# EAGLE design EEZ DIB MUX14D r1B2 (EAGLE 7.2.0)
Assembly variants: Farnell, TME

## Sheet 1 of 3: DIB interface
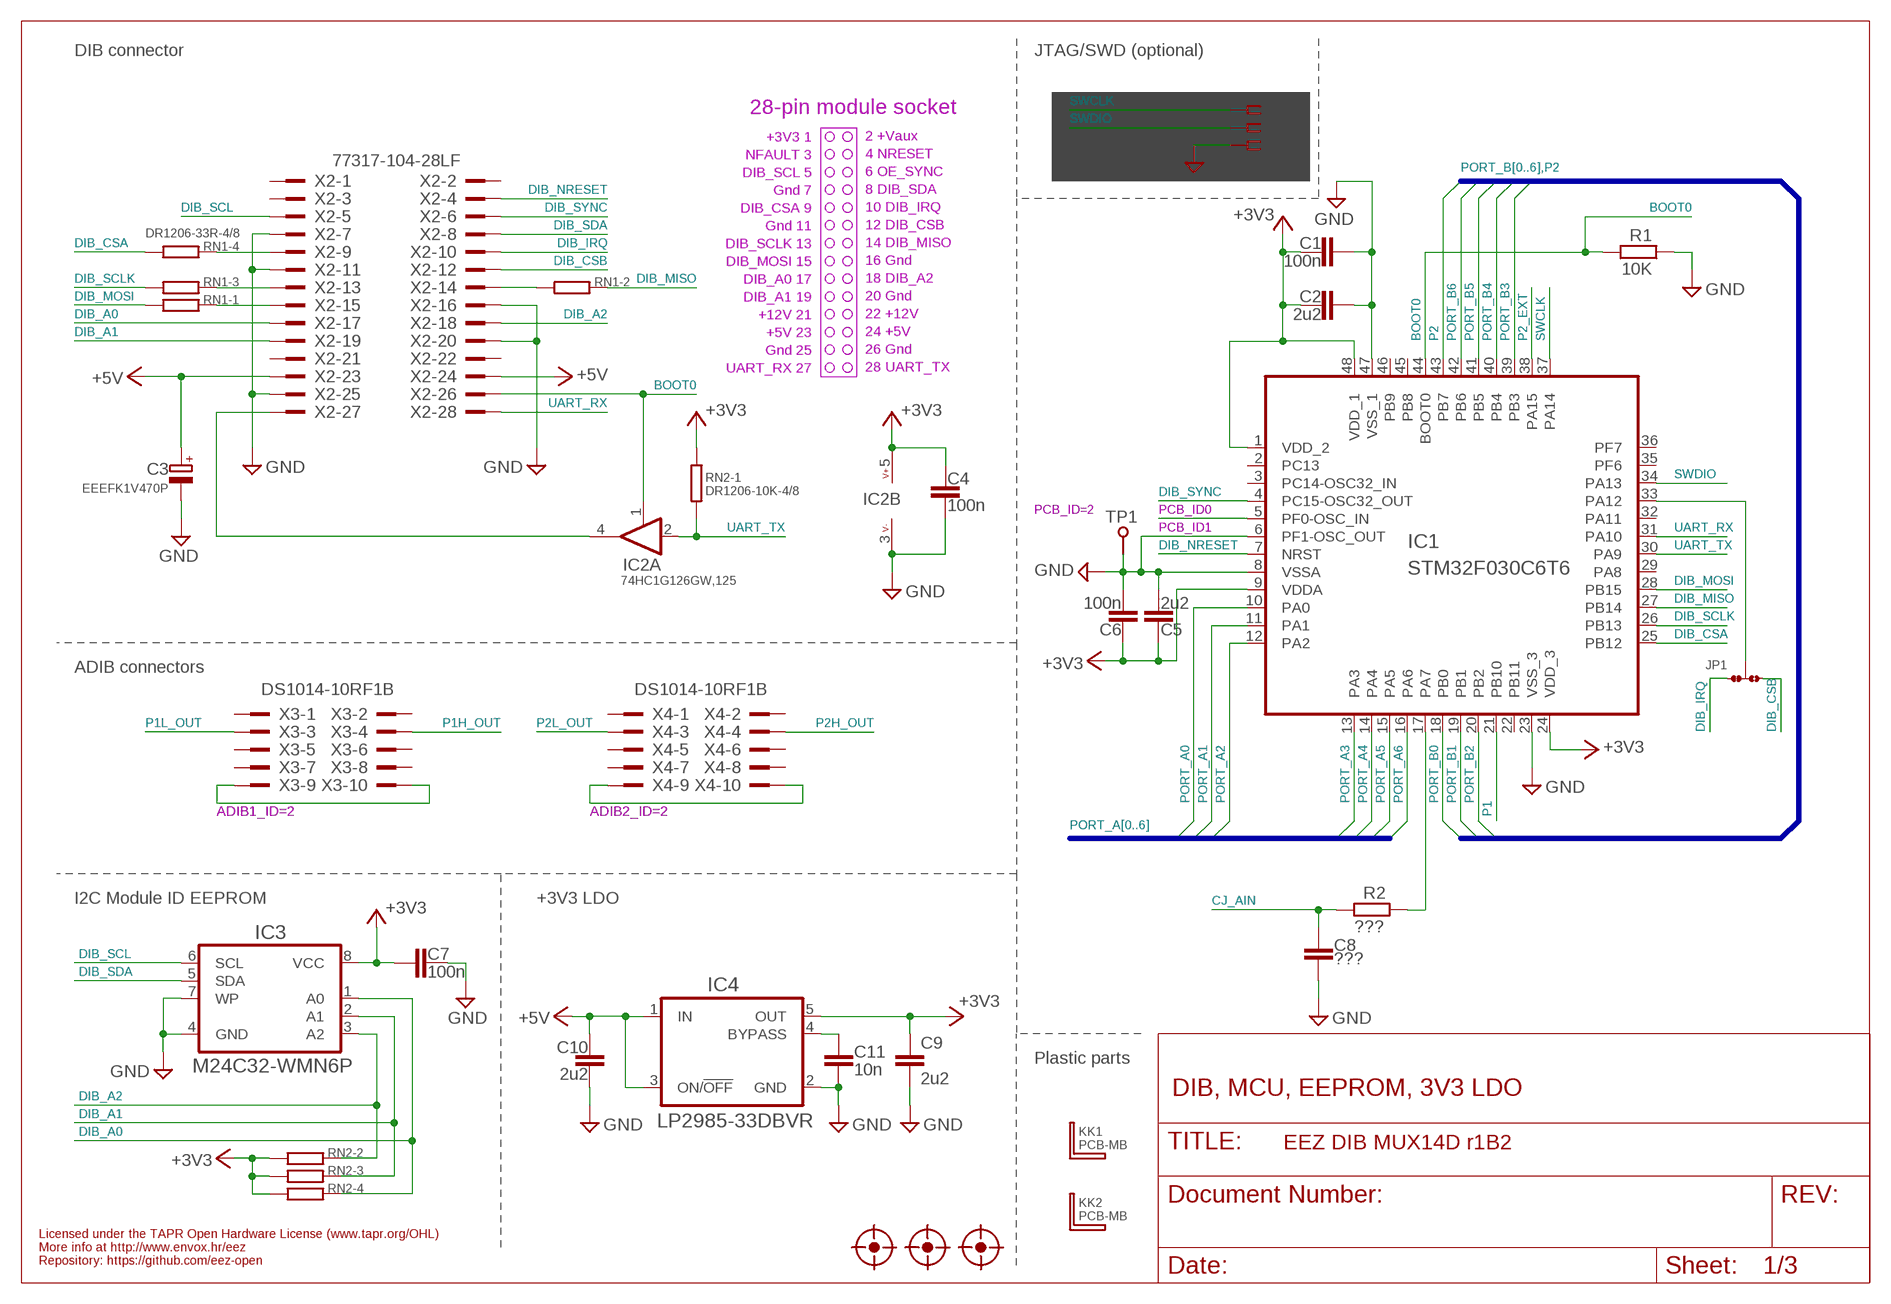
[diagram p0: schematic, sheet 1]

### Parts
C1  100n  C-EUC0603  [C0603]
C2  2u2  C-EUC0805  [C0805]
C3  EEEFK1V470P  ECAPPANASONIC_H  [CAPAE660X610N]
C4  100n  C-EUC0603  [C0603]
C5  2u2  C-EUC0805  [C0805]
C6  100n  C-EUC0603  [C0603]
C7  100n  C-EUC0603  [C0603]
C8  ???  C-EUC0805  [C0805]
C9  2u2  C-EUC0805  [C0805]
C10  2u2  C-EUC0805  [C0805]
C11  10n  C-EUC0805  [C0805]
FM1  FIDUCIAL_2  [FIDUCIAL_DUAL]
FM2  FIDUCIAL_2  [FIDUCIAL_DUAL]
FM3  FIDUCIAL_2  [FIDUCIAL_DUAL]
IC1  STM32F030C6T6  [LQFP-48]
IC2  74HC1G126GW,125  [SOT65P210X110-5N]
IC3  M24C32-WMN6P  AT24CXXSOIC8  [SOIC127P600X173-8N]
IC4  LP2985-33DBVR  LP2985  [SOT95P270X145-5N]
JP1  JP3-CUT-0805-ROTATED  [JP3-0805-CUT2]
KK1  PCB-MB  [PCB-MB]
KK2  PCB-MB  [PCB-MB]
R1  10K  R-EU_R0805  [R0805]
R2  ???  R-EU_R0805  [R0805]
RN1  DR1206-33R-4/8  R_ARRAY4  [CAY16]
RN2  DR1206-10K-4/8  R_ARRAY4  [CAY16]
TP1  PCB_TEST_TABSHIELD  [PCB_SHIELD_TAB]
X1  N.C.  SSW-106-02-S-S  [SSW-106-02-S-S]
X2  77317-104-28LF  [77317-104-28LF]
X3  DS1014-10RF1B  [DS1014-10RF1B]
X4  DS1014-10RF1B  [DS1014-10RF1B]

### Nets
+3V3: C1.2 C2.1 C4.1 C5.2 C6.1 C7.2 C9.1 IC1.1(VDD_2) IC1.9(VDDA) IC1.24(VDD_3) IC1.48(VDD_1) IC2.5(B:V+) IC3.8(VCC) IC4.5(OUT) RN2.5 RN2.6 RN2.7 RN2.8 ; also sheet 2
+5V: C3.1(+) C10.2 IC4.1(IN) IC4.3(ON/!OFF) X2.23 X2.24 ; also sheet 2,3
BOOT0: IC1.44(BOOT0) IC2.1(A:EN) R1.2 X2.26
CJ_AIN: C8.2 R2.2 ; also sheet 2
DIB_A0: IC3.1(A0) RN2.4 X2.17
DIB_A1: IC3.2(A1) RN2.3 X2.19
DIB_A2: IC3.3(A2) RN2.2 X2.18
DIB_CSA: IC1.25(PB12) RN1.4
DIB_CSB: JP1.NO X2.12
DIB_IRQ: JP1.NC X2.10
DIB_MISO: IC1.27(PB14) RN1.2
DIB_MOSI: IC1.28(PB15) RN1.1
DIB_NRESET: IC1.7(NRST) X2.4
DIB_SCL: IC3.6(SCL) X2.5
DIB_SCLK: IC1.26(PB13) RN1.3
DIB_SDA: IC3.5(SDA) X2.8
DIB_SYNC: IC1.4(PC15-OSC32_OUT) X2.6
GND: C1.1 C2.2 C3.2(-) C4.2 C5.1 C6.2 C7.1 C8.1 C9.2 C10.1 C11.1 IC1.6(PF1-OSC_OUT) IC1.8(VSSA) IC1.23(VSS_3) IC1.47(VSS_1) IC2.3(B:V-) IC3.4(GND) IC3.7(WP) IC4.2(GND) R1.1 TP1.1 X1.3 X2.7 X2.11 X2.16 X2.20 X2.25 ; also sheet 2,3
N$1: X3.9 X3.10
N$2: X4.9 X4.10
N$6: IC1.17(PA7) R2.1
N$7: IC1.5(PF0-OSC_IN)
N$69: RN1.5 X2.9
N$70: C11.2 IC4.4(BYPASS)
N$72: IC2.4(A:O) X2.27
N$75: IC1.33(PA12) JP1.COM
N$99: RN1.6 X2.13
N$101: RN1.7 X2.14
N$102: RN1.8 X2.15
P1: IC1.21(PB10) ; also sheet 3
P1H_OUT: X3.4 ; also sheet 2
P1L_OUT: X3.3 ; also sheet 2
P2: IC1.43(PB7) ; also sheet 3
P2_EXT: IC1.38(PA15) ; also sheet 3
P2H_OUT: X4.4 ; also sheet 2
P2L_OUT: X4.3 ; also sheet 2
PORT_A0: IC1.10(PA0) ; also sheet 3
PORT_A1: IC1.11(PA1) ; also sheet 3
PORT_A2: IC1.12(PA2) ; also sheet 3
PORT_A3: IC1.13(PA3) ; also sheet 3
PORT_A4: IC1.14(PA4) ; also sheet 3
PORT_A5: IC1.15(PA5) ; also sheet 3
PORT_A6: IC1.16(PA6) ; also sheet 3
PORT_B0: IC1.18(PB0) ; also sheet 3
PORT_B1: IC1.19(PB1) ; also sheet 3
PORT_B2: IC1.20(PB2) ; also sheet 3
PORT_B3: IC1.39(PB3) ; also sheet 3
PORT_B4: IC1.40(PB4) ; also sheet 3
PORT_B5: IC1.41(PB5) ; also sheet 3
PORT_B6: IC1.42(PB6) ; also sheet 3
SWCLK: IC1.37(PA14) X1.2
SWDIO: IC1.34(PA13) X1.4
UART_RX: IC1.31(PA10) X2.28
UART_TX: IC1.30(PA9) IC2.2(A:I) RN2.1
Unconnected: IC1.2(PC13) IC1.3(PC14-OSC32_IN) IC1.22(PB11) IC1.29(PA8) IC1.32(PA11) IC1.35(PF6) IC1.36(PF7) IC1.45(PB8) IC1.46(PB9) X1.1 X1.5 X1.6 X2.1 X2.2 X2.3 X2.21 X2.22 X3.1 X3.2 X3.5 X3.6 X3.7 X3.8 X4.1 X4.2 X4.5 X4.6 X4.7 X4.8

### Buses
PORT_A[0..6]
PORT_B[0..6],P2

### Notes on the sheet
- DIB connector | JTAG/SWD (optional)
- 28-pin module socket
- +3V3 1
- 2 +Vaux
- NFAULT 3
- 4 NRESET
- DIB_SCL 5
- 6 OE_SYNC
- Gnd 7
- 8 DIB_SDA
- DIB_CSA 9
- 10 DIB_IRQ
- Gnd 11
- 12 DIB_CSB
- DIB_SCLK 13
- 14 DIB_MISO
- DIB_MOSI 15
- 16 Gnd
- DIB_A0 17
- 18 DIB_A2
- DIB_A1 19
- 20 Gnd
- +12V 21
- 22 +12V
- +5V 23
- 24 +5V
- Gnd 25
- 26 Gnd
- UART_RX 27
- 28 UART_TX
- PCB_ID=2 | PCB_ID0
- PCB_ID1
- ADIB connectors
- ADIB1_ID=2 | ADIB2_ID=2
- I2C Module ID EEPROM | +3V3 LDO
- Plastic parts
- DIB, MCU, EEPROM, 3V3 LDO
- Licensed under the TAPR Open Hardware License (www.tapr.org/OHL)
- More info at http://www.envox.hr/eez
- Repository: https://github.com/eez-open

## Sheet 2 of 3
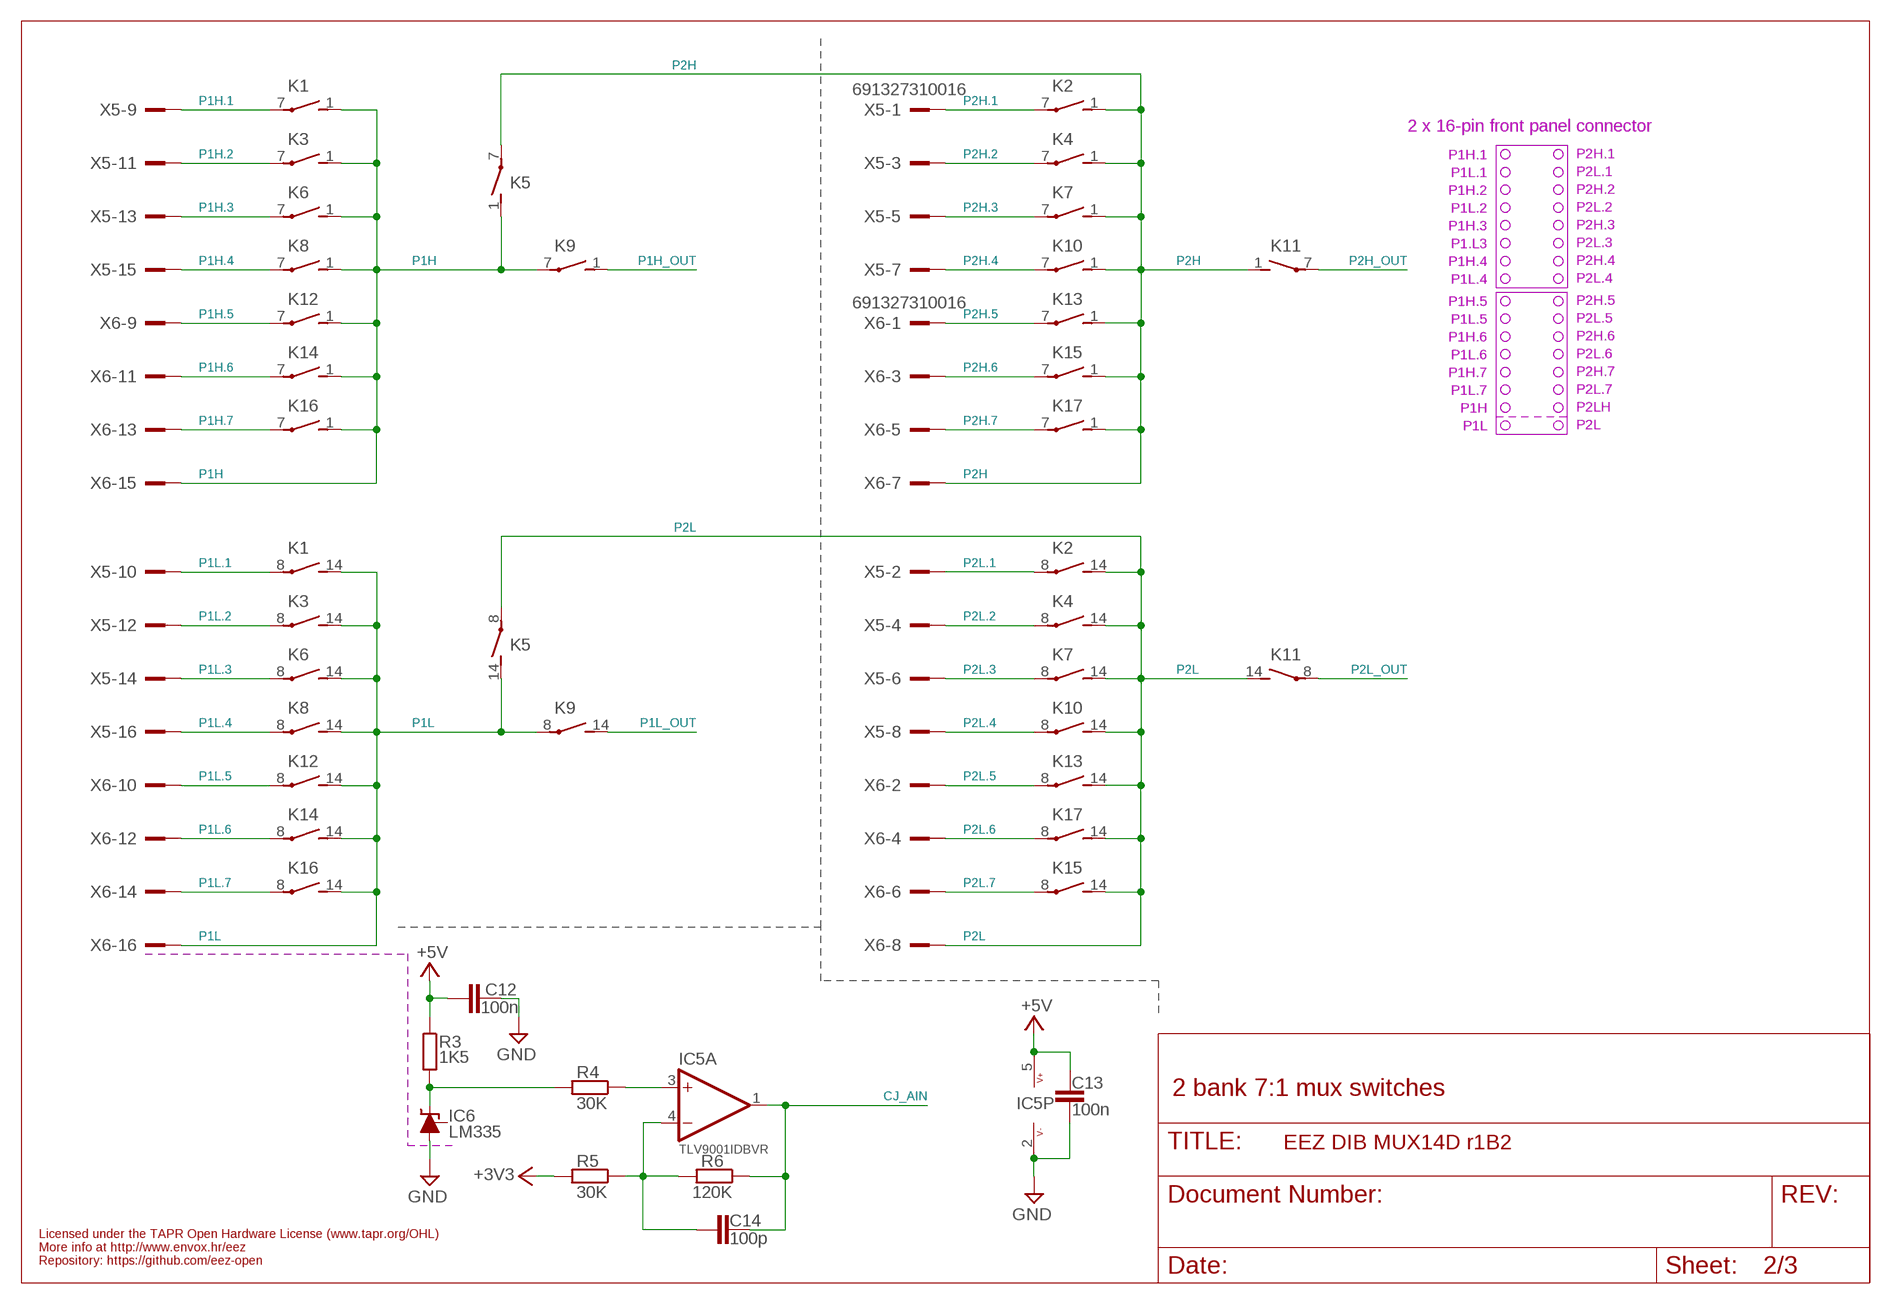
[diagram p1: schematic, sheet 2]

### Parts
C12  100n  C-EUC0603  [C0603]
C13  100n  C-EUC0603  [C0603]
C14  100p  C-EUC0805  [C0805]
IC5  TLV9001IDBVR  OPA376AIDBVR  [DBV5]
IC6  LM335  LM335-TO92  [TO92]
K1  3572.1220.051  RR2A  [RR2A]
K2  3572.1220.051  RR2A  [RR2A]
K3  3572.1220.051  RR2A  [RR2A]
K4  3572.1220.051  RR2A  [RR2A]
K5  3572.1220.051  RR2A  [RR2A]
K6  3572.1220.051  RR2A  [RR2A]
K7  3572.1220.051  RR2A  [RR2A]
K8  3572.1220.051  RR2A  [RR2A]
K9  3572.1220.051  RR2A  [RR2A]
K10  3572.1220.051  RR2A  [RR2A]
K11  3572.1220.051  RR2A  [RR2A]
K12  3572.1220.051  RR2A  [RR2A]
K13  3572.1220.051  RR2A  [RR2A]
K14  3572.1220.051  RR2A  [RR2A]
K15  3572.1220.051  RR2A  [RR2A]
K16  3572.1220.051  RR2A  [RR2A]
K17  3572.1220.051  RR2A  [RR2A]
R3  1K5  R-EU_R0805  [R0805]
R4  30K  R-EU_R0805  [R0805]
R5  30K  R-EU_R0805  [R0805]
R6  120K  R-EU_R0805  [R0805]
X5  691327310016  [691327310016]
X6  691327310016  [691327310016]

### Nets
+3V3: R5.2 ; also sheet 1
+5V: C12.1 C13.1 IC5.5(P:V+) R3.1 ; also sheet 1,3
CJ_AIN: C14.2 IC5.1(A:OUT) R6.1 ; also sheet 1
GND: C12.2 C13.2 IC5.2(P:V-) IC6.3(A) ; also sheet 1,3
N$3: IC6.2(C) R3.2 R4.2
N$183: C14.1 IC5.4(A:-IN) R5.1 R6.2
N$184: IC5.3(A:+IN) R4.1
P1H: K1.1(2:S) K3.1(2:S) K5.1(2:S) K6.1(2:S) K8.1(2:S) K9.7(2:P) K12.1(2:S) K14.1(2:S) K16.1(2:S) X6.15
P1H.1: K1.7(2:P) X5.9
P1H.2: K3.7(2:P) X5.11
P1H.3: K6.7(2:P) X5.13
P1H.4: K8.7(2:P) X5.15
P1H.5: K12.7(2:P) X6.9
P1H.6: K14.7(2:P) X6.11
P1H.7: K16.7(2:P) X6.13
P1H_OUT: K9.1(2:S) ; also sheet 1
P1L: K1.14(3:S) K3.14(3:S) K5.14(3:S) K6.14(3:S) K8.14(3:S) K9.8(3:P) K12.14(3:S) K14.14(3:S) K16.14(3:S) X6.16
P1L.1: K1.8(3:P) X5.10
P1L.2: K3.8(3:P) X5.12
P1L.3: K6.8(3:P) X5.14
P1L.4: K8.8(3:P) X5.16
P1L.5: K12.8(3:P) X6.10
P1L.6: K14.8(3:P) X6.12
P1L.7: K16.8(3:P) X6.14
P1L_OUT: K9.14(3:S) ; also sheet 1
P2H: K2.1(2:S) K4.1(2:S) K5.7(2:P) K7.1(2:S) K10.1(2:S) K11.1(2:S) K13.1(2:S) K15.1(2:S) K17.1(2:S) X6.7
P2H.1: K2.7(2:P) X5.1
P2H.2: K4.7(2:P) X5.3
P2H.3: K7.7(2:P) X5.5
P2H.4: K10.7(2:P) X5.7
P2H.5: K13.7(2:P) X6.1
P2H.6: K15.7(2:P) X6.3
P2H.7: K17.7(2:P) X6.5
P2H_OUT: K11.7(2:P) ; also sheet 1
P2L: K2.14(3:S) K4.14(3:S) K5.8(3:P) K7.14(3:S) K10.14(3:S) K11.14(3:S) K13.14(3:S) K15.14(3:S) K17.14(3:S) X6.8
P2L.1: K2.8(3:P) X5.2
P2L.2: K4.8(3:P) X5.4
P2L.3: K7.8(3:P) X5.6
P2L.4: K10.8(3:P) X5.8
P2L.5: K13.8(3:P) X6.2
P2L.6: K17.8(3:P) X6.4
P2L.7: K15.8(3:P) X6.6
P2L_OUT: K11.8(3:P) ; also sheet 1
Unconnected: IC6.1(ADJ)

### Notes on the sheet
- 2 x 16-pin front panel connector
- P1H.1
- P2H.1
- P1L.1
- P2L.1
- P1H.2
- P2H.2
- P1L.2
- P2L.2
- P1H.3
- P2H.3
- P1.L3
- P2L.3
- P1H.4
- P2H.4
- P1L.4
- P2L.4
- P1H.5
- P2H.5
- P1L.5
- P2L.5
- P1H.6
- P2H.6
- P1L.6
- P2L.6
- P1H.7
- P2H.7
- P1L.7
- P2L.7
- P1H
- P2LH
- P1L
- P2L
- 2 bank 7:1 mux switches
- Licensed under the TAPR Open Hardware License (www.tapr.org/OHL)
- More info at http://www.envox.hr/eez
- Repository: https://github.com/eez-open

## Sheet 3 of 3
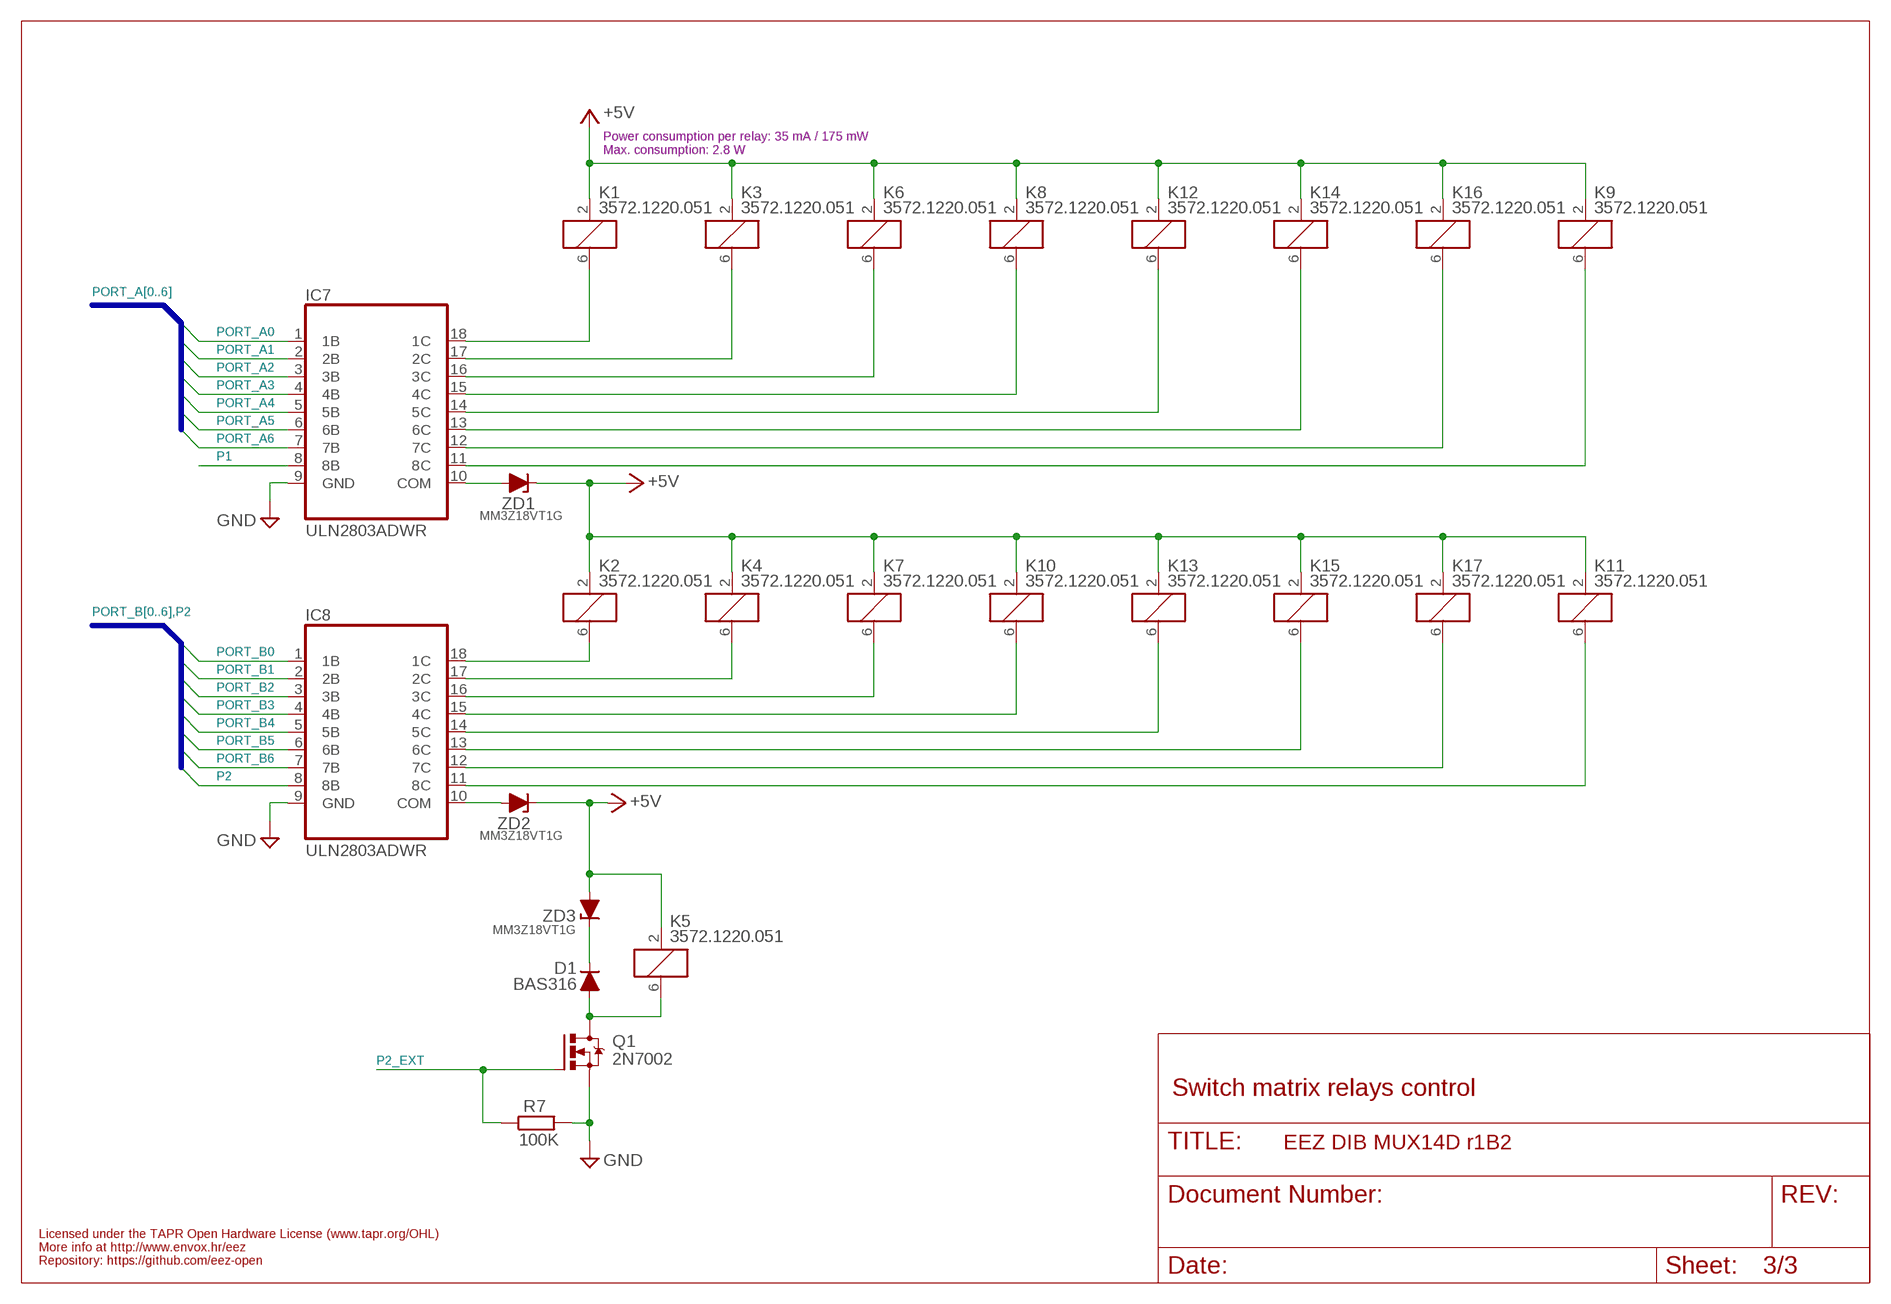
[diagram p2: schematic, sheet 3]

### Parts
D1  BAS316  DIODESOD323R  [SOD323-R]
IC7  ULN2803ADWR  [DW18_TEX-M]
IC8  ULN2803ADWR  [DW18_TEX-M]
Q1  2N7002  [SOT103P240X110-3N]
R7  100K  R-EU_R0805  [R0805]
ZD1  MM3Z18VT1G  ZENER-DIODESOD323R  [SOD323-R]
ZD2  MM3Z18VT1G  ZENER-DIODESOD323R  [SOD323-R]
ZD3  MM3Z18VT1G  ZENER-DIODESOD323R  [SOD323-R]

### Nets
+5V: K1.2 K2.2 K3.2 K4.2 K5.2 K6.2 K7.2 K8.2 K9.2 K10.2 K11.2 K12.2 K13.2 K14.2 K15.2 K16.2 K17.2 ZD1.C ZD2.C ZD3.A ; also sheet 1,2
GND: IC7.9(GND) IC8.9(GND) Q1.2(S) R7.2 ; also sheet 1,2
N$4: D1.C ZD3.C
N$28: IC7.10(COM) ZD1.A
N$30: IC7.18(1C) K1.6
N$32: IC7.17(2C) K3.6
N$34: IC7.16(3C) K6.6
N$35: IC7.15(4C) K8.6
N$36: IC7.14(5C) K12.6
N$38: IC7.13(6C) K14.6
N$40: IC7.12(7C) K16.6
N$42: IC7.11(8C) K9.6
N$43: D1.A K5.6 Q1.3(D)
N$44: IC8.10(COM) ZD2.A
N$46: IC8.18(1C) K2.6
N$48: IC8.17(2C) K4.6
N$50: IC8.16(3C) K7.6
N$52: IC8.15(4C) K10.6
N$54: IC8.14(5C) K13.6
N$56: IC8.13(6C) K15.6
N$58: IC8.12(7C) K17.6
N$60: IC8.11(8C) K11.6
P1: IC7.8(8B) ; also sheet 1
P2: IC8.8(8B) ; also sheet 1
P2_EXT: Q1.1(G) R7.1 ; also sheet 1
PORT_A0: IC7.1(1B) ; also sheet 1
PORT_A1: IC7.2(2B) ; also sheet 1
PORT_A2: IC7.3(3B) ; also sheet 1
PORT_A3: IC7.4(4B) ; also sheet 1
PORT_A4: IC7.5(5B) ; also sheet 1
PORT_A5: IC7.6(6B) ; also sheet 1
PORT_A6: IC7.7(7B) ; also sheet 1
PORT_B0: IC8.1(1B) ; also sheet 1
PORT_B1: IC8.2(2B) ; also sheet 1
PORT_B2: IC8.3(3B) ; also sheet 1
PORT_B3: IC8.4(4B) ; also sheet 1
PORT_B4: IC8.5(5B) ; also sheet 1
PORT_B5: IC8.6(6B) ; also sheet 1
PORT_B6: IC8.7(7B) ; also sheet 1

### Buses
PORT_A[0..6]
PORT_B[0..6],P2

### Notes on the sheet
- Power consumption per relay: 35 mA / 175 mW
  Max. consumption: 2.8 W
- Switch matrix relays control
- Licensed under the TAPR Open Hardware License (www.tapr.org/OHL)
- More info at http://www.envox.hr/eez
- Repository: https://github.com/eez-open

## Library data of the parts
C1 C2 C4-C14 = rcl:C-EU: CAPACITOR, European symbol
C3 = EEZ_Lib1:ECAP
D1 = EEZ_Lib1:DIODE
FM1-FM3 = EEZ_Lib1:FIDUCIAL: Fiducial mark for pick and place automation
IC1 = EEZ_DIB:STM32F030: Arm® 32-bit Cortex®-M0 CPU
IC2 = EEZ_Lib1:74HC1G126: Single Bus Buffer Gate With 3-State Outputs
IC3 = EEZ_Lib1:AT24CXX: I2C-Compatible (2-wire) Serial EEPROM
IC4 = EEZ_DIB:LP2985: 150-mA Low-noise Low-dropout Regulator With Shutdown
IC5 = EEZ_TI:OPA376A: Low-Noise, Low Quiescent Current, Precision Operational Amplifier
IC6 = EEZ_TI:LM335: Precision temperature sensor
IC7 IC8 = EEZ_TI:ULN2803A: 8 Darlington Transistor Array (500mA, 50V)
JP1 = EEZ_Lib1:JP3-CUT
K1-K17 = EEZ_switches:RR2A: Reed relay, 2 Form A
KK1 KK2 = EEZ_Lib1:PCB-MB: Richo Mounting Block; 16 x 6 mm
Q1 = EEZ_Lib1:2N7002: N-CHANNEL ENHANCEMENT MODE FIELD EFFECT TRANSISTOR; MPN: 2N7002-7-F; OC_FARNELL: 1713823; OC_NEWARK: 25R5679; PACKAGE: SOT-23-3; SUPPLIER: DIODES INC.
R1-R7 = rcl:R-EU_: RESISTOR, European symbol
RN1 RN2 = EEZ_Lib1:R_ARRAY4: 1206 four resistor array
TP1 = EEZ_Lib1:PCB_TEST_TAB
X1 = con-samtec:SSW-106-02-S-S: THROUGH-HOLE .025" SQ POST SOCKET Source: Samtec SSW.pdf; MPN: SSW-106-02-S-S; OC_FARNELL: unknown; OC_NEWARK: 11P9416
X2 = EEZ_connectors:77317-104-28LF: Headers & Wire Housings 28P right angle 0.1" pitch
X3 X4 = EEZ_connectors:DS1014-10RF1B: 10-pin IDC 2mm Socket; male; 90°; THT
X5 X6 = EEZ_connectors:691327310016: WR-TBL Serie 3273 – 3.81mm Close Horizontal Dual Row PCB Header, 16 Pins
ZD1-ZD3 = EEZ_Lib1:ZENER-DIODE

## Net classes
0 default: width 0.203 mm, drill 0.3 mm, clearance 0.203 mm
1 lvds: width 0.152 mm, drill 0.3 mm, clearance 0.152 mm to class 0, clearance 0.152 mm
2 gnd: width 0.254 mm, drill 0.584 mm, clearance 0.254 mm
3 diff_in: width 0.254 mm, drill 0.584 mm, clearance 0.203 mm to class 0, clearance 0.203 mm to class 1, clearance 0.203 mm to class 2, clearance 0.203 mm

## Board
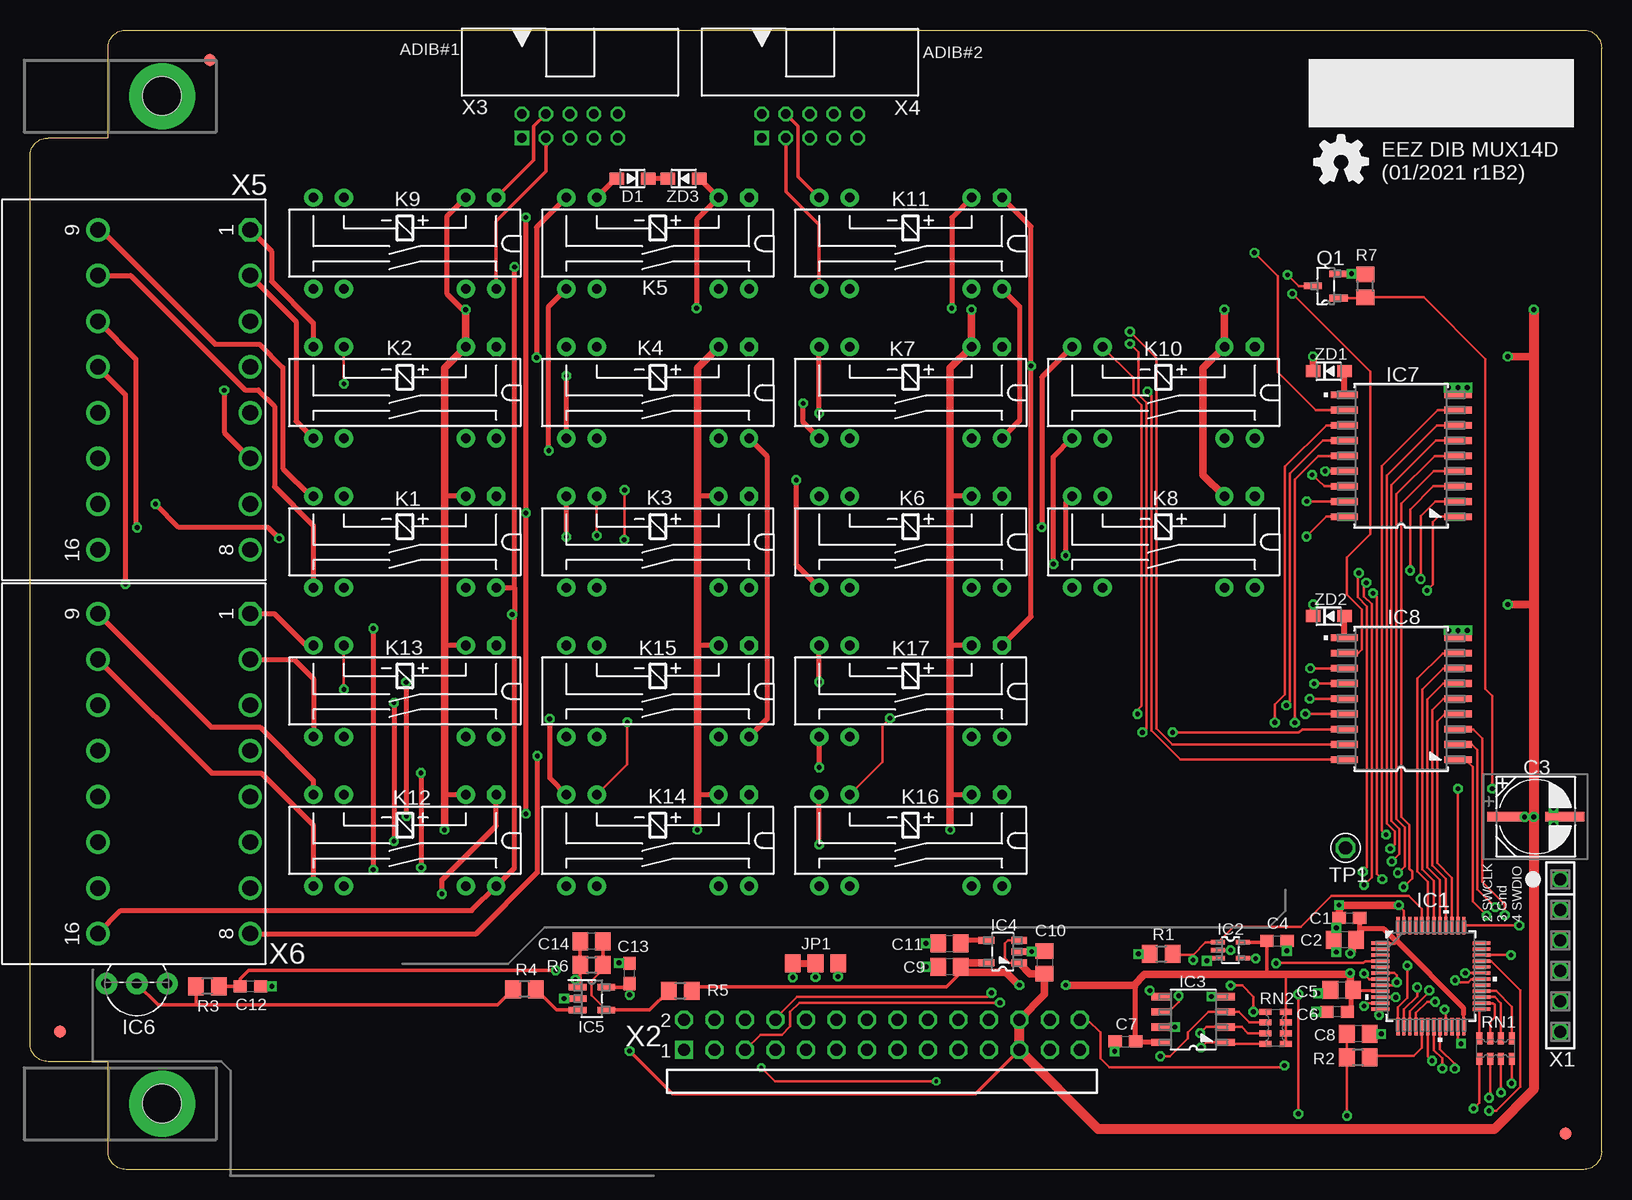
[diagram p3: board, top side]
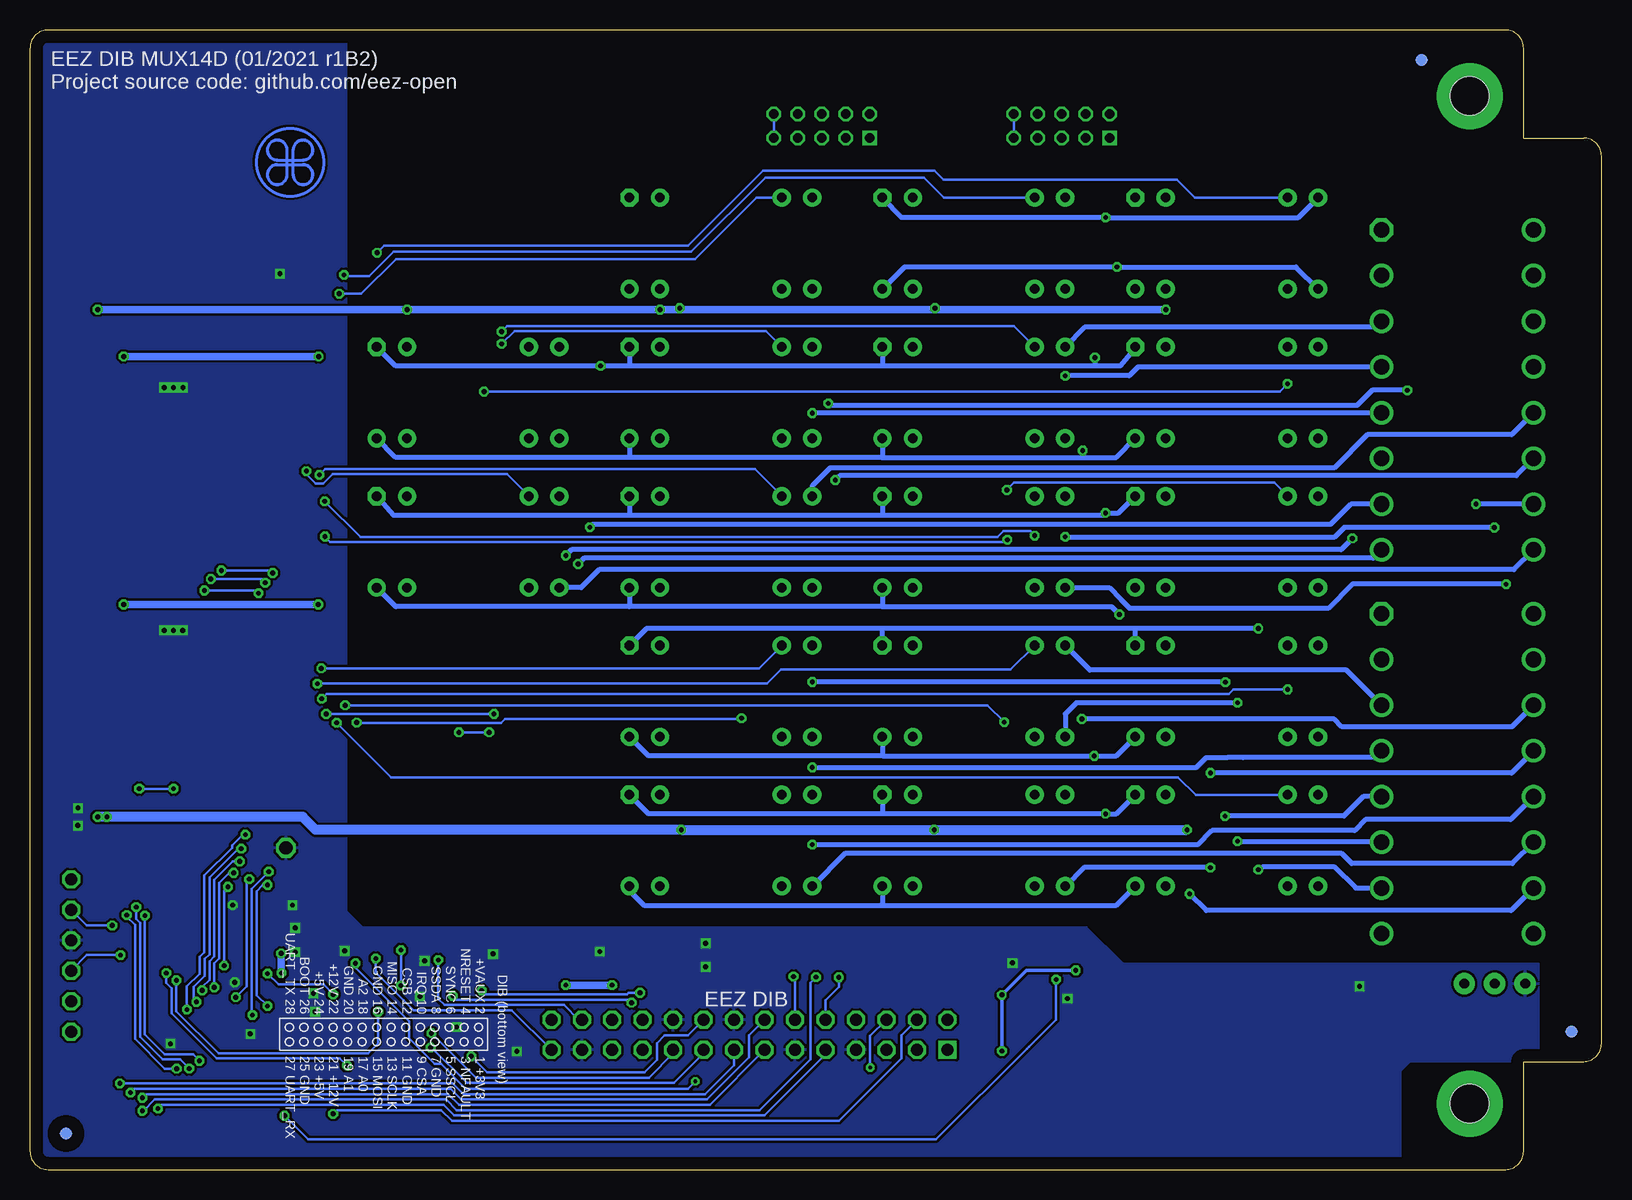
[diagram p4: board, bottom side, seen from below]

Size 131 x 95 mm. Coordinates in mm from the lower left corner, seen from the top.
Outline: 8,95 129.5,95 arc-90 131,93.5 131,1.5 arc-90 129.5,0 8,0 arc-90 6.5,1.5 6.5,9 1.5,9 arc-90 0,10.5 0,84.5 arc-90 1.5,86 6.5,86 6.5,93.5 arc-90 8,95
Copper layers (1*16): Top 0.035mm / dielectric 1.5mm / Bottom 0.035mm
Design rules "default *": minimum track width 6mil, minimum drill 0.3mm, track to track 6mil, track to pad 6mil, pad to pad 6mil, via to via 6mil, smd to smd 6mil, copper to edge 40mil, drill to drill 8mil, minimum pad ring 4mil, minimum via ring 8mil, stop-mask expansion 2.5mil, vias tented up to drill 1mm, thermal gap 8mil
vRestrict: area 0,0 to 42,14; area 53,0 to 128,8.5

### Footprints (pad centres in the part's own frame; a part is rotated, then mirrored left to right if it is on the bottom)
C0603 = smd 1.1 x 1: 1 -0.85,0; 2 0.85,0
C0805 = smd 1.3 x 1.5: 1 -0.95,0; 2 0.95,0
CAPAE660X610N = smd 3.251 x 0.762: 1 -2.413,0; 2 2.413,0
SOD323-R = smd 1.2 x 1: A 1.3,0; C -1.3,0
FIDUCIAL_DUAL = smd 1.016 x 1.016 bottom: B 0,0 | smd 1.016 x 1.016: T 0,0
LQFP-48 = smd 1.473 x 0.279: 1 -4.216,2.743; 2 -4.216,2.261; 3 -4.216,1.753; 4 -4.216,1.245; 5 -4.216,0.762; 6 -4.216,0.254; 7 -4.216,-0.254; 8 -4.216,-0.762; 9 -4.216,-1.245; 10 -4.216,-1.753; 11 -4.216,-2.261; 12 -4.216,-2.743; 25 4.216,-2.743; 26 4.216,-2.261; 27 4.216,-1.753; 28 4.216,-1.245; 29 4.216,-0.762; 30 4.216,-0.254; 31 4.216,0.254; 32 4.216,0.762; 33 4.216,1.245; 34 4.216,1.753; 35 4.216,2.261; 36 4.216,2.743 | smd 0.279 x 1.473: 13 -2.743,-4.216; 14 -2.261,-4.216; 15 -1.753,-4.216; 16 -1.245,-4.216; 17 -0.762,-4.216; 18 -0.254,-4.216; 19 0.254,-4.216; 20 0.762,-4.216; 21 1.245,-4.216; 22 1.753,-4.216; 23 2.261,-4.216; 24 2.743,-4.216; 37 2.743,4.216; 38 2.261,4.216; 39 1.753,4.216; 40 1.245,4.216; 41 0.762,4.216; 42 0.254,4.216; 43 -0.254,4.216; 44 -0.762,4.216; 45 -1.245,4.216; 46 -1.753,4.216; 47 -2.261,4.216; 48 -2.743,4.216
SOT65P210X110-5N = smd 1.168 x 0.356: 1 -1.041,0.66; 2 -1.041,0; 3 -1.041,-0.66; 4 1.041,-0.66; 5 1.041,0.66
SOIC127P600X173-8N = smd 1.55 x 0.6: 1 -2.7,1.9; 2 -2.7,0.63; 3 -2.7,-0.64; 4 -2.7,-1.91; 5 2.7,-1.91; 6 2.7,-0.64; 7 2.7,0.63; 8 2.7,1.9
SOT95P270X145-5N = smd 1.321 x 0.559: 1 -1.372,0.94; 2 -1.372,0; 3 -1.372,-0.94; 4 1.372,-0.94; 5 1.372,0.94
DBV5 = smd 1.473 x 0.559: 1 -1.194,0.95; 2 -1.194,0; 3 -1.194,-0.95; 4 1.194,-0.95; 5 1.194,0.95
TO92 = drill 0.813 pad 1.778: 1 -2.54,0; 2 0,0; 3 2.54,0
DW18_TEX-M = smd 2.286 x 0.559: 1 -4.737,5.08; 2 -4.737,3.81; 3 -4.737,2.54; 4 -4.737,1.27; 5 -4.737,0; 6 -4.737,-1.27; 7 -4.737,-2.54; 8 -4.737,-3.81; 9 -4.737,-5.08; 10 4.737,-5.08; 11 4.737,-3.81; 12 4.737,-2.54; 13 4.737,-1.27; 14 4.737,0; 15 4.737,1.27; 16 4.737,2.54; 17 4.737,3.81; 18 4.737,5.08
JP3-0805-CUT2 = smd 1.3 x 1.5: COM 0,0; NC 1.9,0; NO -1.9,0
RR2A = drill 0.8 pad 1.524 octagon: 1 -7.62,-3.81 | drill 0.8 pad 1.524: 2 -5.08,-3.81; 6 5.08,-3.81; 7 7.62,-3.81; 8 7.62,3.81; 9 5.08,3.81; 13 -5.08,3.81; 14 -7.62,3.81
PCB-MB = hole 3.2: 0,0
SOT103P240X110-3N = smd 1.524 x 0.559: 1 -1.079,1.016; 2 -1.079,-1.016; 3 1.079,0
R0805 = smd 1.3 x 1.5: 1 -0.95,0; 2 0.95,0
CAY16 = smd 0.5 x 1: 1 -1.35,-0.85; 2 -0.45,-0.85; 3 0.45,-0.85; 4 1.35,-0.85; 5 1.35,0.85; 6 0.45,0.85; 7 -0.45,0.85; 8 -1.35,0.85
PCB_SHIELD_TAB = drill 1.1 octagon: 1 0,0
SSW-106-02-S-S = drill 1 pad 1.5 octagon: 1 -6.35,0; 2 -3.81,0; 3 -1.27,0; 4 1.27,0; 5 3.81,0; 6 6.35,0
77317-104-28LF = drill 1 pad 1.5 square: 1 -33.02,-2.54 | drill 1 pad 1.5 octagon: 2 -33.02,0; 3 -30.48,-2.54; 4 -30.48,0; 5 -27.94,-2.54; 6 -27.94,0; 7 -25.4,-2.54; 8 -25.4,0; 9 -22.86,-2.54; 10 -22.86,0; 11 -20.32,-2.54; 12 -20.32,0; 13 -17.78,-2.54; 14 -17.78,0; 15 -15.24,-2.54; 16 -15.24,0; 17 -12.7,-2.54; 18 -12.7,0; 19 -10.16,-2.54; 20 -10.16,0; 21 -7.62,-2.54; 22 -7.62,0; 23 -5.08,-2.54; 24 -5.08,0; 25 -2.54,-2.54; 26 -2.54,0; 27 0,-2.54; 28 0,0
DS1014-10RF1B = drill 0.8 square: 1 -4,-1 | drill 0.8 octagon: 2 -4,1; 3 -2,-1; 4 -2,1; 5 0,-1; 6 0,1; 7 2,-1; 8 2,1; 9 4,-1; 10 4,1
691327310016 = drill 1.3 octagon: 1 -13.335,6.35 | drill 1.3: 2 -9.525,6.35; 3 -5.715,6.35; 4 -1.905,6.35; 5 1.905,6.35; 6 5.715,6.35; 7 9.525,6.35; 8 13.335,6.35; 9 -13.335,-6.35; 10 -9.525,-6.35; 11 -5.715,-6.35; 12 -1.905,-6.35; 13 1.905,-6.35; 14 5.715,-6.35; 15 9.525,-6.35; 16 13.335,-6.35

### Placement (x,y rotation side)
C1  109.98,20.97 0 top
C2  109.6,19.14 180 top
C3  125.51,29.41 0 top
C4  103.95,19.05 0 top
C5  109.35,14.99 0 top
C6  108.97,13.14 180 top
C7  91.31,10.67 0 top
C8  110.72,11.3 180 top
C9  76.64,16.89 180 top
C10  84.58,17.27 270 top
C11  76.64,18.86 0 top
C12  18.38,15.29 0 top
C13  49.97,16.34 90 top
C14  46.81,19.02 180 top
D1  50.23,82.61 180 top
EEZ_SIGNATURE  SIGNATURESMALL  [SIGNATURE_5MM]  109.32,83.96 180 top
FM1  2.5,11.5 0 top
FM2  15,92.5 0 top
FM3  128,3 0 top
IC1  116.78,16.13 0 top
IC2  100.08,18.29 0 top
IC3  96.96,12.51 180 top
IC4  81.09,18.16 180 top
IC5  46.84,14.25 0 top
IC6  8.9,15.49 180 top
IC7  114.3,59.5 180 top
IC8  114.3,39.24 180 top
JP1  65.48,17.17 180 top
K1  31.24,52.32 180 top
K2  31.24,64.77 180 top
K3  52.32,52.32 180 top
K4  52.32,64.77 180 top
K5  52.32,77.22 180 top
K6  73.41,52.32 180 top
K7  73.41,64.77 180 top
K8  94.49,52.32 180 top
K9  31.24,77.22 180 top
K10  94.49,64.77 180 top
K11  73.41,77.22 180 top
K12  31.24,27.43 180 top
K13  31.24,39.88 180 top
K14  52.32,27.43 180 top
K15  52.32,39.88 180 top
K16  73.41,27.43 180 top
K17  73.41,39.88 180 top
KK1  11,89.5 0 top
KK2  11,5.5 0 top
Q1  108.01,73.66 180 top
R1  94.3,17.97 0 top
R2  110.72,9.33 180 top
R3  14.8,15.29 180 top
R4  41.22,15.04 180 top
R5  54.2,14.91 0 top
R6  46.81,17.06 0 top
R7  111.32,73.66 90 top
RN1  122.17,10.1 180 top
RN2  103.82,11.81 270 top
TP1  109.66,26.81 0 top
X1  127.57,17.84 270 top
X2  87.54,12.5 0 top
X3  45,87 0 top
X4  65,87 0 top
X5  12,65 270 top
X6  12,33 270 top
ZD1  108.27,66.56 0 top
ZD2  108.27,46.13 0 top
ZD3  54.48,82.61 0 top

### Tracks (layer width: path | path; a pad name or v marks a point on that pad's centre or on a via)
+3V3  (via drill 0.4)
  Top 0.203: RN2.5 RN2.6 RN2.7 RN2.8 104.67,16.17 104.33,16.26
  Top 0.254: IC1.24 119.52,12.94 | IC1.48 114.03,19.13 114.01,18.96 | IC1.1 113.81,18.87 113.92,18.99 | 110.42,15.37 110.05,14.99 | IC1.9 110.4,14.88 C5.2
  Top 0.305: 103.06,16.26 103.1,16.3 C4.1 103.1,18.95 IC2.5 | 101.69,16.23 101.66,16.26 | 105.86,16.32 105.79,16.26 | 77.59,16.7 77.59,16.57 | C9.1 77.59,16.44 76.39,15.24 55.48,15.24 R5.2
  Top 0.406: IC3.8 92.22,10.61 C7.2 92.16,15.22 92.01,15.37 | 119.52,12.94 119.52,13.45 114.01,18.96 113.92,18.99 112.84,20.07 110.88,20.07 110.82,20 | C1.2 110.82,20.96 110.82,20 | 110.82,20 110.82,19.68 110.55,19.42 C2.1 | C6.1 109.97,13.14 110.13,13.31 110.13,14.82 C5.2
  Top 0.61: C9.1 77.59,16.7 77.78,16.7 | IC4.5 77.92,17.22 C9.1 | C5.2 110.05,14.99 v110.05,16.38 109.92,16.26 105.79,16.26 104.33,16.26 103.06,16.26 101.66,16.26 92.9,16.26 92.01,15.37 v86.33,15.37 | v82.49,15.37 82.44,15.37 81.36,16.45 77.85,16.45 77.85,16.63 C9.1 | C2.1 110.25,18.84 110.25,18.2 v110.06,18.01
  Bottom 0.61: v86.33,15.37 v82.49,15.37 | v110.06,18.01 110.06,16.4 v110.05,16.38
+5V  (via drill 0.4)
  Top 0.203: IC4.3 81.51,19.1 81.27,18.86 81.27,17.63 81.66,17.23 82.45,17.23 IC4.1
  Top 0.254: IC4.1 82.43,17.19
  Top 0.305: R3.1 C12.1 17.53,15.9 18.21,16.59 43.81,16.59 v43.83,16.6 | IC5.5 49.68,15.2 C13.1 49.99,15.48 v49.99,14.55 | v49.97,9.88 53.56,6.3 78.8,6.3 X2.23
  Top 0.406: K1.2 34.54,56.13 | K13.2 34.8,43.69 34.54,43.94 | K15.2 55.82,43.69 55.63,43.5 | K3.2 55.63,56.13 | K6.2 76.9,56.13 76.71,55.94 | K17.2 76.77,43.69 76.71,43.62 | K12.2 34.54,31.24 | K14.2 55.75,31.24 55.63,31.11 | K16.2 76.77,31.24 76.71,31.3 | ZD3.A 55.82,82.61 K5.2 55.56,79.18 v55.56,71.82 | K9.2 34.73,79.44 34.73,73.03 36.07,71.69 v36.32,71.69 | K11.2 76.83,79.38 v76.83,71.82
  Top 0.61: X2.24 84.58,14.62 C10.2 83.36,16.32 IC4.1 | 125.34,29.41 v125.35,29.4 v124.59,29.4 123.11,29.4 C3.1 | ZD1.C 106.97,67.76 v106.95,67.78 | ZD2.C v106.97,47.1 | v123.19,47.1 125.35,47.1 | v55.63,28.32 55.63,31.11 55.63,43.5 55.63,56.13 55.63,66.8 K4.2 | v76.71,28.32 76.71,31.3 76.71,43.62 76.71,55.94 76.71,66.8 K7.2 v78.49,71.69 | v36.32,71.69 K2.2 34.54,66.8 34.54,56.13 34.54,43.94 34.54,31.24 v34.54,28.32 | v123.19,67.78 125.31,67.78 125.35,67.82 | v99.57,71.69 K10.2 97.79,66.8 97.79,57.91 K8.2
  Top 0.813: X2.24 X2.23 89.06,3.37 122.05,3.37 125.35,6.67 v125.35,29.4 125.35,47.1 125.35,67.82 v125.35,71.69
  Bottom 0.305: v49.97,9.88 49.97,14.54 v49.99,14.55 47.94,16.6 v43.83,16.6
  Bottom 0.406: 68.33,71.75 68.26,71.69 | v55.56,71.82 55.56,71.69 | v76.83,71.82 76.83,71.69
  Bottom 0.61: v106.95,67.78 v123.19,67.78 | v106.97,47.1 v123.19,47.1 | v36.32,71.69 55.56,71.69 68.26,71.69 76.83,71.69 v78.49,71.69 v99.57,71.69 v125.35,71.69
  Bottom 0.813: v125.35,29.4 108.27,29.4 107.19,28.32 v76.71,28.32 v55.63,28.32 v34.54,28.32
BOOT0  (via drill 0.4)
  Top 0.203: v96.97,17.46 96.97,17.91 | 96.97,17.91 97.98,18.92 99.01,18.92 IC2.1 100.32,20.23 105.92,20.23 108.5,22.81 114.92,22.81 116.01,21.72 IC1.44 | R1.2 95.31,17.91 96.97,17.91
  Bottom 0.203: X2.26 85.27,12.5 86.49,13.72 96.46,13.72 96.97,14.22 v96.97,17.46
CJ_AIN  (via drill 0.4)
  Top 0.203: C8.2 R2.2 v109.78,4.48 | 45.86,15.42 45.86,15.44 v45.47,15.84
  Top 0.305: C14.2 R6.1 45.86,15.42 IC5.1
  Bottom 0.203: v109.78,4.48 107.8,2.5 55.46,2.5 47.88,10.08 47.74,10.22 45.47,12.5 v45.47,15.84
DIB_A0  (via drill 0.4)
  Top 0.203: RN2.4 99.81,10.46 IC3.1 98.05,10.61 v97.6,10.16
  Bottom 0.203: X2.17 74.84,9.69 77.32,7.21 94.56,7.21 97.51,10.16 v97.6,10.16
DIB_A1  (via drill 0.4)
  Top 0.203: RN2.3 101.54,11.37 101.02,11.88 IC3.2 98.05,11.88 v97.54,11.37
  Bottom 0.203: X2.19 77.38,9.69 79.42,7.66 93.83,7.66 v97.54,11.37
DIB_A2  (via drill 0.4)
  Top 0.203: RN2.2 101.66,12.26 100.77,13.15 IC3.3 98.24,13.15 96.52,11.43 96.52,10.95 95.01,9.44 v94.22,9.44
  Bottom 0.203: X2.18 76.16,11.18 78.11,11.18 78.74,10.54 78.74,9.13 79.77,8.1 92.89,8.1 v94.22,9.44
DIB_CSA
  Top 0.203: RN1.4 120.82,13.32 IC1.25
DIB_CSB  (via drill 0.4)
  Top 0.203: JP1.NO 67.38,16.12 v67.35,16.09
  Bottom 0.203: X2.12 67.22,15.96 v67.35,16.09
DIB_IRQ  (via drill 0.4)
  Top 0.203: v63.58,16.03 JP1.NC
  Bottom 0.203: X2.10 64.68,14.12 63.58,15.23 v63.58,16.03
DIB_MISO
  Top 0.203: RN1.2 122.62,13.84 122.08,14.38 IC1.27
DIB_MOSI
  Top 0.203: RN1.1 123.52,13.57 122.21,14.88 IC1.28
DIB_NRESET  (via drill 0.4)
  Top 0.203: v105.73,14.61 v105.73,4.64 | IC1.7 111.66,15.88 v111.2,16.33
  Bottom 0.203: X2.4 58.36,11.2 58.36,9.27 63.56,4.06 95.82,4.06 96.71,4.95 105.41,4.95 v105.73,4.64 | v105.73,14.61 106.54,15.42 110.29,15.42 v111.2,16.33
DIB_SCL  (via drill 0.4)
  Top 0.203: X2.5 59.62,9.96 60.9,11.24 62.67,11.24 63.37,11.94 63.37,13.14 64.14,13.91 v80.85,13.91 | IC3.6 94.94,13.15 95.76,13.97 v95.76,14.48
  Bottom 0.203: v95.76,14.48 95.44,14.16 81.1,14.16 v80.85,13.91
DIB_SCLK
  Top 0.203: RN1.3 121.72,12.31 122.11,12.7 122.11,13.72 121.96,13.87 IC1.26
DIB_SDA  (via drill 0.4)
  Top 0.203: X2.8 62.14,12.61 63.94,14.41 79.83,14.41 v80.15,14.73 | IC3.5 93.85,14.42 v93.34,14.92
  Bottom 0.203: v93.34,14.92 93.03,14.61 81.23,14.61 81.1,14.73 v80.15,14.73
DIB_SYNC  (via drill 0.3, 0.4)
  Top 0.203: v75.53,7.35 62.1,7.35 v60.97,8.48 | IC1.4 111.3,17.37 111.16,17.23 103.92,17.23 v103.87,17.18
  Bottom 0.203: v75.53,7.35 76.14,6.74 94.68,6.74 96.74,8.8 97.28,8.8 99.4,10.92 99.4,12.36 103.85,16.8 103.85,17.18 v103.87,17.18 | v60.97,8.48 60.97,11.13 X2.6
GND  (via drill 0.4)
  Top 0.203: C4.2 v104.78,18.22 | IC3.4 v98.49,14.42 v98.49,14.41 | IC1.8 113.69,15.37 v113.93,15.61 113.93,16.17 113.72,16.38 IC1.6 | IC1.47 114.52,21.57 v114.11,22.04 | IC1.23 119.04,10.74 v119.29,10.49 | v127.01,28.68 127.01,29.38 127.03,29.39 127.9,29.39 C3.2 | IC7.9 v119.04,65.19 | C2.2 108.89,19.38 v108.89,20.14 | R1.1 v92.39,17.97 | v107.38,14.69 108.11,14.69 C5.1 | C8.1 v112.64,11.3 | v44.53,14.25 IC5.2 | 50.27,17.3 C13.2 49.12,17.2 v49.1,17.22
  Top 0.254: C6.2 v107.23,13.14
  Top 0.305: IC2.3 98.11,17.63 v98.11,17.4 | v83.5,18.16 84.52,18.16 C10.1 | C12.2 v20.17,15.28
  Top 0.406: C11.1 v74.68,18.86 | C9.2 v74.68,16.89 | C7.1 v90.42,9.84 | IC3.7 v95.44,11.88 v95.44,11.87 | IC4.2 v83.5,18.16 | Q1.2 v110.17,74.68 110.24,74.61 R7.2
  Top 0.508: IC8.9 v119.04,44.95
  Top 0.61: v114.11,22.04 v109.13,22.04 109.13,21.97 C1.1
  other vias: 108.9,18.12 118.26,44.95 119.82,44.95 127,30.14 119.82,65.19 118.25,65.19
  pour Bottom (isolate 0.203): 39.85,17.13 42.93,20.19 103.29,20.19 104.65,21.55 104.65,95 131.57,95 131.57,-0.51 16.76,-0.51 16.76,8.19 15.94,9.02 5.27,9.02 5.27,17.14
HOLE_DL  (via drill 3.2 pad 5.5)
  other vias: 11,5.5
HOLE_UL  (via drill 3.2 pad 5.5)
  other vias: 11,89.5
N$1
  Bottom 0.203: X3.10 X3.9
N$2
  Bottom 0.203: X4.10 X4.9
N$3
  Top 0.305: 13.85,15.09 R3.2 13.85,13.83 13.95,13.73 | IC6.2 10.67,13.73 13.95,13.73 | 13.95,13.73 38.97,13.73 R4.2
N$4
  Top 0.406: ZD3.C D1.C
N$6
  Top 0.203: IC1.17 116.01,10.15 115.35,9.49 111.82,9.49 R2.1
N$28
  Top 0.508: IC7.10 ZD1.A
N$30  (via drill 0.4)
  Top 0.203: v49.57,56.64 49.57,52.51 v49.53,52.5 | IC7.18 108.06,54.42 v106.41,52.77
  Bottom 0.203: K1.6 27.28,57.25 48.96,57.25 v49.57,56.64 | v49.53,52.5 49.68,52.32 105.97,52.32 v106.41,52.77
N$32  (via drill 0.4)
  Top 0.203: K3.6 v47.24,52.84 | v106.43,55.7 109.55,55.7 IC7.17
  Bottom 0.203: v47.24,52.84 47.59,53.21 49.86,53.21 50.34,52.73 103.45,52.73 v106.43,55.7
N$34  (via drill 0.4)
  Top 0.203: v106.88,57.91 107.89,56.96 IC7.16
  Bottom 0.203: K6.6 70.57,58.38 106.41,58.38 v106.88,57.91
N$35  (via drill 0.4)
  Top 0.203: IC7.15 109.55,58.22 v107.96,58.22
  Bottom 0.203: K8.6 91.25,57.98 105.78,57.98 106.55,57.2 107.17,57.2 107.96,57.99 v107.96,58.22
N$36  (via drill 0.4)
  Top 0.203: IC7.14 107.42,59.5 105.44,57.52 v105.44,37.25
  Bottom 0.203: K12.6 33.83,31.24 35.29,32.7 100.89,32.7 v105.44,37.25
N$38  (via drill 0.4)
  Top 0.203: IC7.13 107.76,60.77 105.03,58.04 105.03,39 v104.72,38.7 | K14.6 49.78,33.78 v49.78,37.3
  Bottom 0.203: v49.78,37.3 51.18,38.7 v104.72,38.7
N$40  (via drill 0.4)
  Top 0.203: IC7.12 108.06,62.04 104.62,58.6 104.62,39.61 103.77,38.76 v103.77,37.26 | v71.69,37.62 71.07,36.99 71.07,33.98 K16.6
  Bottom 0.203: v71.69,37.62 71.74,37.57 91.42,37.57 91.73,37.25 v103.76,37.25 v103.77,37.26
N$42  (via drill 0.4)
  Top 0.203: IC7.11 107.17,63.31 104.03,66.46 104.03,74.47 v102.07,76.43
  Bottom 0.203: K9.6 33.9,81.03 35.4,82.53 54.84,82.53 55.59,83.27 69.91,83.27 76.15,77.04 101.46,77.04 v102.07,76.43
N$43  (via drill 0.4)
  Top 0.203: v104.83,74.59 105.75,73.66 Q1.3
  Top 0.406: D1.A 48.83,82.61 K5.6
  Bottom 0.203: K5.6 54.8,81.03 56.46,82.69 69.7,82.69 75.88,76.5 100.7,76.5 102.73,74.47 104.71,74.47 v104.83,74.59
N$44
  Top 0.508: IC8.10 ZD2.A
N$46  (via drill 0.4)
  Top 0.203: K2.6 v26.16,65.52 v26.18,65.51 | IC8.18 109.55,34.18 95.89,34.18 93.47,36.59 93.47,64.54 v93.15,64.86
  Bottom 0.203: v26.18,65.51 26.82,64.86 v93.15,64.86
N$48  (via drill 0.4)
  Top 0.203: v91.68,69.85 93.89,67.64 93.89,36.75 95.21,35.43 IC8.17
  Bottom 0.203: K4.6 48.98,70.32 91.21,70.32 v91.68,69.85
N$50  (via drill 0.4)
  Top 0.203: v95.25,36.45 105.79,36.45 106.05,36.7 IC8.16 | v92.73,36.45 93.07,36.78 93.07,63.92 92.39,64.59 92.39,68.14 v91.69,68.83
  Bottom 0.203: K7.6 69.66,69.91 90.61,69.91 v91.69,68.83 | v95.25,36.45 v92.73,36.45
N$52  (via drill 0.4)
  Top 0.203: v106.31,37.97 IC8.15 | v92.33,37.97 92.33,38.32 92.66,38.65 92.66,63.74 91.96,64.44 91.96,66.03 K10.6
  Bottom 0.203: v106.31,37.97 v92.33,37.97
N$54  (via drill 0.4)
  Top 0.203: K13.6 v26.16,40.02 | v106.68,39.24 IC8.14
  Bottom 0.203: v26.16,40.02 30.7,40.02 31.08,39.64 106.29,39.64 v106.68,39.24
N$56  (via drill 0.4)
  Top 0.203: v107.05,40.5 107.06,40.51 IC8.13
  Bottom 0.203: K15.6 49.25,41.68 68.38,41.68 69.56,40.5 v107.05,40.5
N$58  (via drill 0.4)
  Top 0.203: v106.72,41.78 IC8.12
  Bottom 0.203: K17.6 70.23,41.78 v106.72,41.78
N$60  (via drill 0.4)
  Top 0.203: IC8.11 110.73,43.05 111.02,43.34 111.02,46.67 109.75,47.94 109.75,51.02 111.72,52.98 111.72,66.51 v105.22,73.01
  Bottom 0.203: K11.6 70.42,81.03 75.55,75.89 100.5,75.89 103.38,73.01 v105.22,73.01
N$69  (via drill 0.4)
  Top 0.203: RN1.5 120.82,5.57 v120.33,5.08
  Bottom 0.203: X2.9 64.68,9.62 69.79,4.51 95.63,4.51 96.52,5.4 120.02,5.4 v120.33,5.08
N$70
  Top 0.406: IC4.4 77.84,19.1 C11.2
N$72  (via drill 0.4)
  Top 0.203: IC2.4 102.13,17.63 v102.17,17.59
  Bottom 0.203: X2.27 90.85,13.27 99.02,13.27 99.83,14.08 100.53,14.78 102.17,16.42 v102.17,17.59
N$75  (via drill 0.4)
  Top 0.203: IC1.33 121.79,17.37 124.23,14.94 124.23,6.9 122.24,4.9 v121.63,4.9 | JP1.COM v65.48,16.04
  Bottom 0.203: v121.63,4.9 121.53,4.9 120.59,5.84 96.33,5.84 95.44,4.95 70.17,4.95 65.95,9.17 65.95,15.57 v65.48,16.04
N$99  (via drill 0.4)
  Top 0.203: RN1.6 121.72,6.08 v121.63,5.98
  Bottom 0.203: X2.13 74.32,5.4 95.25,5.4 96.14,6.29 121.32,6.29 v121.63,5.98
N$101  (via drill 0.4)
  Top 0.203: RN1.7 v122.62,6.42 v122.62,6.41
  Bottom 0.203: X2.14 71.06,11.2 71.06,9.34 74.55,5.84 95.06,5.84 95.95,6.73 122.3,6.73 v122.62,6.41
N$102  (via drill 0.4)
  Top 0.203: RN1.8 123.52,7.19 v123.51,7.18
  Bottom 0.203: v123.51,7.18 95.76,7.18 94.87,6.29 74.74,6.29 72.33,8.7 72.33,9.93 X2.15
N$183
  Top 0.203: R6.2 47.76,16.68 46.8,15.72 46.8,14.53 IC5.4
  Top 0.305: C14.1 R6.2 | IC5.4 51.64,13.3 R5.1
N$184
  Top 0.305: IC5.3 43.91,13.3 R4.1
P1  (via drill 0.4)
  Top 0.203: v113.04,27.91 112.69,28.27 112.69,58.64 117.36,63.31 IC7.8 | IC1.21 118.02,13.23 v117.92,13.34
  Bottom 0.203: v117.92,13.34 117.92,15.27 116.86,16.32 116.86,17.72 116.46,18.12 116.46,24.51 114.16,26.81 114.16,27.04 113.28,27.91 v113.04,27.91
P1H  (via drill 0.4)
  Top 0.406: v41.34,29.65 41.34,54.19 v41.34,54.74 v41.34,79.38 | v34.34,22.97 34.34,24.16 34.35,24.16 38.86,28.66 K12.1
  Bottom 0.406: K8.1 100.71,54.55 81.03,54.55 | 81.03,54.55 60.05,54.55 | K12.1 40.45,29.65 v41.34,29.65 60.07,29.65 | 60.07,29.65 79.44,29.65 K16.1 | K14.1 59.94,29.78 60.07,29.65 | K3.1 59.94,54.65 60.05,54.55 | K6.1 81.03,54.55 | X6.15 7.54,21.59 32.96,21.59 v34.34,22.97 | K1.1 40.26,54.74 v41.34,54.74 41.53,54.55 60.05,54.55 | K5.1 59.94,80.96 58.36,79.38 v41.34,79.38 25.27,79.38 K9.7
P1H.1
  Top 0.406: X5.9 5.89,78.33 15.42,68.81 19.14,68.81 21.08,66.86 21.08,58.45 23.39,56.13 K1.7
P1H.2  (via drill 0.4)
  Top 0.406: X5.11 5.68,70.72 8.83,67.56 8.83,53.62 v8.93,53.52 | K3.7 v44.7,52.74
  Bottom 0.406: v44.7,52.74 22.24,52.74 21.45,53.53 9.27,53.53 9.26,53.52 v8.93,53.52
P1H.3
  Bottom 0.406: X5.13 7.49,61.25 19.52,61.25 22.28,58.5 64.3,58.5 65.79,57.01 K6.7
P1H.4  (via drill 0.4)
  Top 0.406: v20.77,52.62 19.85,53.53 12.41,53.53 v10.46,55.47 | 86.61,55.88 K8.7 86.33,55.6 v86.33,51.19
  Bottom 0.406: v20.77,52.62 21.7,51.68 85.85,51.68 v86.33,51.19 | X5.15 v10.46,55.48 v10.46,55.47
P1H.5
  Top 0.406: X6.9 15.09,36.89 19.18,36.89 23.62,32.45 K12.7
P1H.6  (via drill 0.4)
  Top 0.406: v43.32,37.57 43.32,32.63 K14.7
  Bottom 0.406: X6.11 7.46,36.91 21.64,36.91 22.29,37.55 43.31,37.55 v43.32,37.57
P1H.7  (via drill 0.4)
  Top 0.406: v65.79,27.08 K16.7
  Bottom 0.406: X6.13 7.57,29.17 19.67,29.17 20.57,28.27 32.46,28.27 33.66,27.08 v65.79,27.08
P1H_OUT
  Top 0.305: X3.4 42,87 42,85.11 42,84.84 42,84.16 K9.1
P1L  (via drill 0.4)
  Top 0.406: K1.14 40.39,48.51 | 40.39,48.51 40.39,46.47 v40.18,46.27 40.39,46.06 40.39,25.15 K12.14 36.83,21.59 7.58,21.59 X6.16 | 40.39,48.51 v40.39,75.25
  Bottom 0.406: 59.94,46.93 81.03,46.93 | 81.03,46.93 100.52,46.93 K8.14 | K3.14 59.94,46.93 | K6.14 81.03,46.93 | K16.14 81.03,23.24 79.82,22.04 60.07,22.04 | 60.07,22.04 40.45,22.04 K12.14 | K14.14 59.94,22.16 60.07,22.04 | 59.94,46.93 40.84,46.93 v40.18,46.27 | K9.8 25.46,75.25 v40.39,75.25 58.1,75.25 K5.14
P1L.1
  Top 0.406: X5.10 8.39,74.53 17.93,64.99 19.02,64.99 20.38,63.63 20.38,56.93 23.62,53.7 K1.8
P1L.2  (via drill 0.4)
  Top 0.406: X5.12 7.94,64.62 7.94,48.81 v7.95,48.79
  Bottom 0.406: v7.95,48.79 20.78,48.79 22.78,46.79 39.32,46.79 40.07,47.54 40.06,47.54 41.03,48.51 K3.8
P1L.3  (via drill 0.4)
  Top 0.406: v63.87,57.48 63.87,50.43 K6.8
  Bottom 0.406: X5.14 7.1,57.84 63.51,57.84 v63.87,57.48
P1L.4
  Bottom 0.406: X5.16 7.3,50.01 83.55,50.01 85.05,48.51 K8.8
P1L.5
  Top 0.406: X6.10 15.13,33.05 19.29,33.05 23.62,28.71 K12.8
P1L.6  (via drill 0.4)
  Top 0.406: v32.59,33.06 32.59,25.18 v32.6,25.17
  Bottom 0.406: X6.12 7.5,33.06 v32.59,33.06 | v32.6,25.17 43.16,25.17 K14.8
P1L.7
  Bottom 0.406: X6.14 7.43,25.5 20.83,25.5 21.67,26.34 63.07,26.34 K16.8
P1L_OUT
  Top 0.305: K9.14 38.86,79.08 43,83.22 X3.3
P2
  Top 0.203: IC8.8 119.02,43.04 117.75,43.04 115.66,40.95 115.66,24.85 116.52,23.99 IC1.43
P2_EXT  (via drill 0.4)
  Top 0.203: IC1.38 v119.04,31.75 | Q1.1 111.25,72.64 R7.1 116.18,72.71 121.32,67.56 121.32,40.04 121.89,39.47 v121.89,31.75
  Bottom 0.203: v119.04,31.75 v121.89,31.75
P2H  (via drill 0.4)
  Top 0.406: v28.61,45.11 v28.61,24.99 | K5.7 42.23,78.55 v42.23,67.69 | K17.1 83.44,46.1 v83.44,66.99 83.44,78.61 K11.1
  Bottom 0.406: K2.1 38.86,68.52 40.13,66.99 42.23,66.99 | 42.23,66.99 59.94,66.99 | 59.94,66.99 81.03,66.99 | K10.1 100.52,66.99 v83.44,66.99 81.03,66.99 | 81.03,66.99 K7.1 81.03,68.9 | K4.1 59.94,66.99 | v28.61,45.11 38.88,45.11 | 38.88,45.11 59.98,45.11 | 59.98,45.11 79.6,45.11 K17.1 | K15.1 59.94,45.07 59.98,45.11 | X6.7 20.5,23.47 22.25,25.22 28.27,25.22 v28.61,24.99 | K13.1 38.86,45.1 38.88,45.11 | v42.23,67.69 42.23,66.99
P2H.1
  Top 0.406: X5.1 20.14,76.54 20.14,74.05 23.62,70.57 K2.7
P2H.2
  Bottom 0.406: K4.7 43.05,70.23 18.83,70.23 X5.3
P2H.3  (via drill 0.4)
  Top 0.406: v65.79,63.06 K7.7
  Bottom 0.406: X5.5 18.39,63.06 v65.79,63.06
P2H.4  (via drill 0.4)
  Top 0.406: K10.7 84.34,66.05 v84.34,53.54
  Bottom 0.406: X5.7 20.89,55.48 22.57,53.8 84.09,53.8 v84.34,53.54
P2H.5
  Top 0.406: X6.1 20.36,46.34 23.01,43.69 K13.7
P2H.6
  Bottom 0.406: X6.3 21.27,41.63 42.65,41.63 K15.7
P2H.7  (via drill 0.4)
  Top 0.406: v31.38,29.46 31.38,40.6 v31.36,40.63 | v65.79,40.64 K17.7
  Bottom 0.406: X6.5 19.84,31.09 21.48,29.46 v31.38,29.46 | v31.36,40.63 65.77,40.63 v65.79,40.64
P2H_OUT
  Top 0.305: X4.4 64.02,86.98 64.02,82.79 K11.7
P2L  (via drill 0.4)
  Top 0.406: v42.29,34.48 42.29,24.77 37.19,19.66 X6.8 | K15.14 61.47,37.59 61.47,59.44 K4.14 | v43.24,59.94 43.24,71.94 K5.8 | K11.14 82.49,71.94 82.49,62.42 K7.14
  Bottom 0.406: 60.01,59.37 80.9,59.37 | 80.9,59.37 100.52,59.37 K10.14 | K7.14 81.03,59.5 80.9,59.37 | K4.14 59.94,59.44 60.01,59.37 | 60.01,59.37 43.24,59.37 | 43.24,59.37 40.45,59.37 K2.14 | 59.94,34.48 v42.29,34.48 40.45,34.48 K13.14 | K15.14 59.94,34.48 | 59.94,34.48 79.44,34.48 K17.14 | v43.24,59.94 43.24,59.37
P2L.1
  Top 0.406: X5.2 22.19,70.69 22.19,62.4 K2.8
P2L.2  (via drill 0.4)
  Top 0.406: v44.7,66.17 K4.8
  Bottom 0.406: X5.4 38.63,66.91 39.37,66.17 v44.7,66.17
P2L.3  (via drill 0.4)
  Top 0.406: v16.19,64.96 16.19,61.44 X5.6 | K7.8 64.45,62.29 v64.45,63.88
  Bottom 0.406: v16.19,64.96 19.11,64.96 20.38,63.69 64.26,63.69 v64.45,63.88
P2L.4  (via drill 0.4)
  Top 0.406: v85.31,50.48 85.31,59.4 K10.8
  Bottom 0.406: X5.8 19.05,50.97 84.82,50.97 v85.31,50.48
P2L.5
  Top 0.406: X6.2 22.02,42.52 23.64,40.91 23.64,36.08 K13.8
P2L.6  (via drill 0.4)
  Top 0.406: K17.8 v65.79,33.53
  Bottom 0.406: X6.4 18.91,34.34 29.9,34.34 31.19,34.34 32.96,34.34 33.77,33.53 v65.79,33.53
P2L.7  (via drill 0.4)
  Top 0.406: v30.34,38.91 v30.34,27.37
  Bottom 0.406: v30.34,38.91 43.78,38.91 44.7,37.99 K15.8 | v30.34,27.37 18.99,27.37 X6.6
P2L_OUT
  Top 0.305: X4.3 63,81.54 65.79,78.75 K11.8
PORT_A0  (via drill 0.4)
  Top 0.203: IC1.10 112.57,14.36 v113.84,14.36 | IC7.1 117.39,54.42 116.95,53.99 116.95,48.77 v116.46,48.27 | v111.95,48.04 112.27,47.73 112.27,24.66 v112.72,24.21
  Bottom 0.203: v116.46,48.27 112.18,48.27 v111.95,48.04 | v112.72,24.21 112.93,24 112.93,15.28 v113.84,14.36
PORT_A1  (via drill 0.4)
  Top 0.203: IC1.11 111.44,13.87 v111.2,13.63 | 119.02,55.7 IC7.2 117.13,55.69 115.93,54.48 v115.93,49.23 | v111.39,48.92 111.2,48.73 111.2,47.78 111.85,47.13 111.85,24.37 v111.2,23.72
  Bottom 0.203: v111.2,13.63 112.12,14.54 112.12,23.2 111.59,23.72 v111.2,23.72 | v115.93,49.23 111.7,49.23 v111.39,48.92
PORT_A2  (via drill 0.4)
  Top 0.203: v112.46,12.88 112.46,13.28 IC1.12 | v111.1,24.83 111.44,25.17 111.44,46.95 110.68,47.71 110.68,49.64 v110.77,49.73 | IC7.3 116.98,56.96 115.05,55.03 v115.05,49.94
  Bottom 0.203: 111.24,24.69 v111.1,24.83 112.52,23.41 112.52,12.94 v112.46,12.88 | v115.05,49.94 110.97,49.94 v110.77,49.73
PORT_A3  (via drill 0.4)
  Top 0.203: v114.5,23.56 115.21,24.27 115.21,24.87 115,25.08 115,28.71 114.31,29.4 114.31,55.54 117,58.23 IC7.4 | IC1.13 114.03,13.53 114.82,14.31 v114.82,16.99
  Bottom 0.203: v114.82,16.99 114.82,23.24 v114.5,23.56
PORT_A4  (via drill 0.4)
  Top 0.203: IC7.5 117.11,59.5 113.91,56.3 113.91,29.22 114.59,28.54 114.59,25.29 v114.03,24.73 | IC1.14 114.52,13.34 115.63,14.45 v115.63,15.19
  Bottom 0.203: v115.63,15.19 115.63,17.2 115.23,17.6 115.23,23.91 114.41,24.73 v114.03,24.73
PORT_A5  (via drill 0.4)
  Top 0.203: IC7.6 117.2,60.77 113.5,57.07 113.5,29.05 114.16,28.38 114.16,26.33 v113.53,25.69 | IC1.15 115.02,13.18 116.65,14.81 v116.65,14.94
  Bottom 0.203: v116.65,14.94 116.65,15.21 116.04,15.82 116.04,17.37 115.63,17.78 115.63,24.16 114.1,25.69 v113.53,25.69
PORT_A6  (via drill 0.4)
  Top 0.203: IC1.16 115.53,13.04 116.47,13.98 v117.13,13.98 | IC7.7 117.27,62.04 113.09,57.86 113.09,28.87 113.75,28.21 113.75,27.1 v113.4,26.75
  Bottom 0.203: v117.13,13.98 117.36,14.21 117.36,15.24 116.45,16.15 116.45,17.55 116.04,17.96 116.04,24.35 113.64,26.75 v113.4,26.75
PORT_B0  (via drill 0.4)
  Top 0.203: IC1.18 116.52,9.42 v116.88,9.07 | IC8.1 119.66,34.16 120.26,33.57 120.26,22.34 v121.42,21.17
  Bottom 0.203: v121.42,21.17 121.42,11.25 119.77,9.6 117.41,9.6 v116.88,9.07
PORT_B1  (via drill 0.4)
  Top 0.203: 121.83,22.2 v122.15,21.88 120.66,23.37 120.66,34.98 120.21,35.43 IC8.2 | IC1.19 117.03,9.94 117.72,9.26 117.72,8.43 v117.73,8.42
  Bottom 0.203: v117.73,8.42 117.73,8.43 118.49,9.2 119.95,9.2 121.83,11.07 121.83,20.57 122.16,20.9 122.16,21.87 v122.15,21.88
PORT_B2  (via drill 0.4)
  Top 0.203: IC1.20 117.54,10.03 118.77,8.8 v118.77,8.41 | IC8.3 120.32,36.7 121.08,35.94 121.08,23.98 122.94,22.12 v122.94,21.21
  Bottom 0.203: v118.77,8.41 119.76,8.41 122.24,10.88 122.24,20.38 122.94,21.08 v122.94,21.21
PORT_B3
  Top 0.203: IC1.39 118.53,24.33 117.3,25.57 117.3,37.35 117.92,37.97 IC8.4
PORT_B4
  Top 0.203: IC1.40 118.02,24.24 116.89,25.38 116.89,38.32 117.82,39.24 IC8.5
PORT_B5
  Top 0.203: IC1.41 117.54,24.14 116.48,25.2 116.48,39.17 117.83,40.51 IC8.6
PORT_B6
  Top 0.203: IC1.42 117.03,24.07 116.06,25.03 116.06,40.02 117.83,41.78 IC8.7
SWCLK  (via drill 0.4)
  Top 0.203: IC1.37 v124.14,20.34
  Bottom 0.203: v124.14,20.34 126.26,20.34 X1.2
SWDIO  (via drill 0.4)
  Top 0.203: IC1.34 v123.46,17.88
  Bottom 0.203: v123.46,17.88 126.26,17.88 X1.4
UART_RX  (via drill 0.4)
  Top 0.203: X2.28 88.15,12.5 89.23,11.42 89.23,9.27 89.99,8.51 104.41,8.51 v104.57,8.67 | IC1.31 v119.63,16.38
  Bottom 0.203: v119.63,16.38 119.63,15.54 119.2,15.11 119.2,13.03 115.44,9.27 105.17,9.27 v104.57,8.67
UART_TX  (via drill 0.4)
  Top 0.203: RN2.1 102.76,13.16 102.74,13.14 v101.98,13.14 101.98,14.41 101.05,15.34 v100.08,15.34 | v100.08,18.29 IC2.2 | IC1.30 120.13,15.88 119.88,15.62 118.95,15.62 v118.8,15.77
  Bottom 0.203: v100.08,18.29 v100.08,15.34 | v118.8,15.77 118.8,13.21 115.27,9.68 102.83,9.68 101.98,10.53 v101.98,13.14

### Text on the board
tPlace: ADIB#1 | ADIB#2 | EEZ DIB MUX14D / (01/2021 r1B2) | 2 SWCLK / 3 Gnd / 4 SWDIO
bPlace: EEZ DIB MUX14D (01/2021 r1B2) / Project source code: github.com/eez-open | DIB (bottom view) | EEZ DIB | +VAUX 2 / NRESET 4 / SYNC 6 / SSDA 8 / IRQ 10 / CSB 12 / MISO 14 / GND 16 / A2 18 / GND 20 / +12V 22 / +5V 24 / BOOT 26 / UART_TX 28 | 1 +3V3 / 3 NFAULT / 5 SSCL / 7 GND / 9 CSA / 11 GND / 13 SCLK / 15 MOSI / 17 A0 / 19 A1 / 21 +12V / 23 +5V / 25 GND / 27 UART_RX